# EAGLE design stmbluepill (EAGLE 9.6.2)
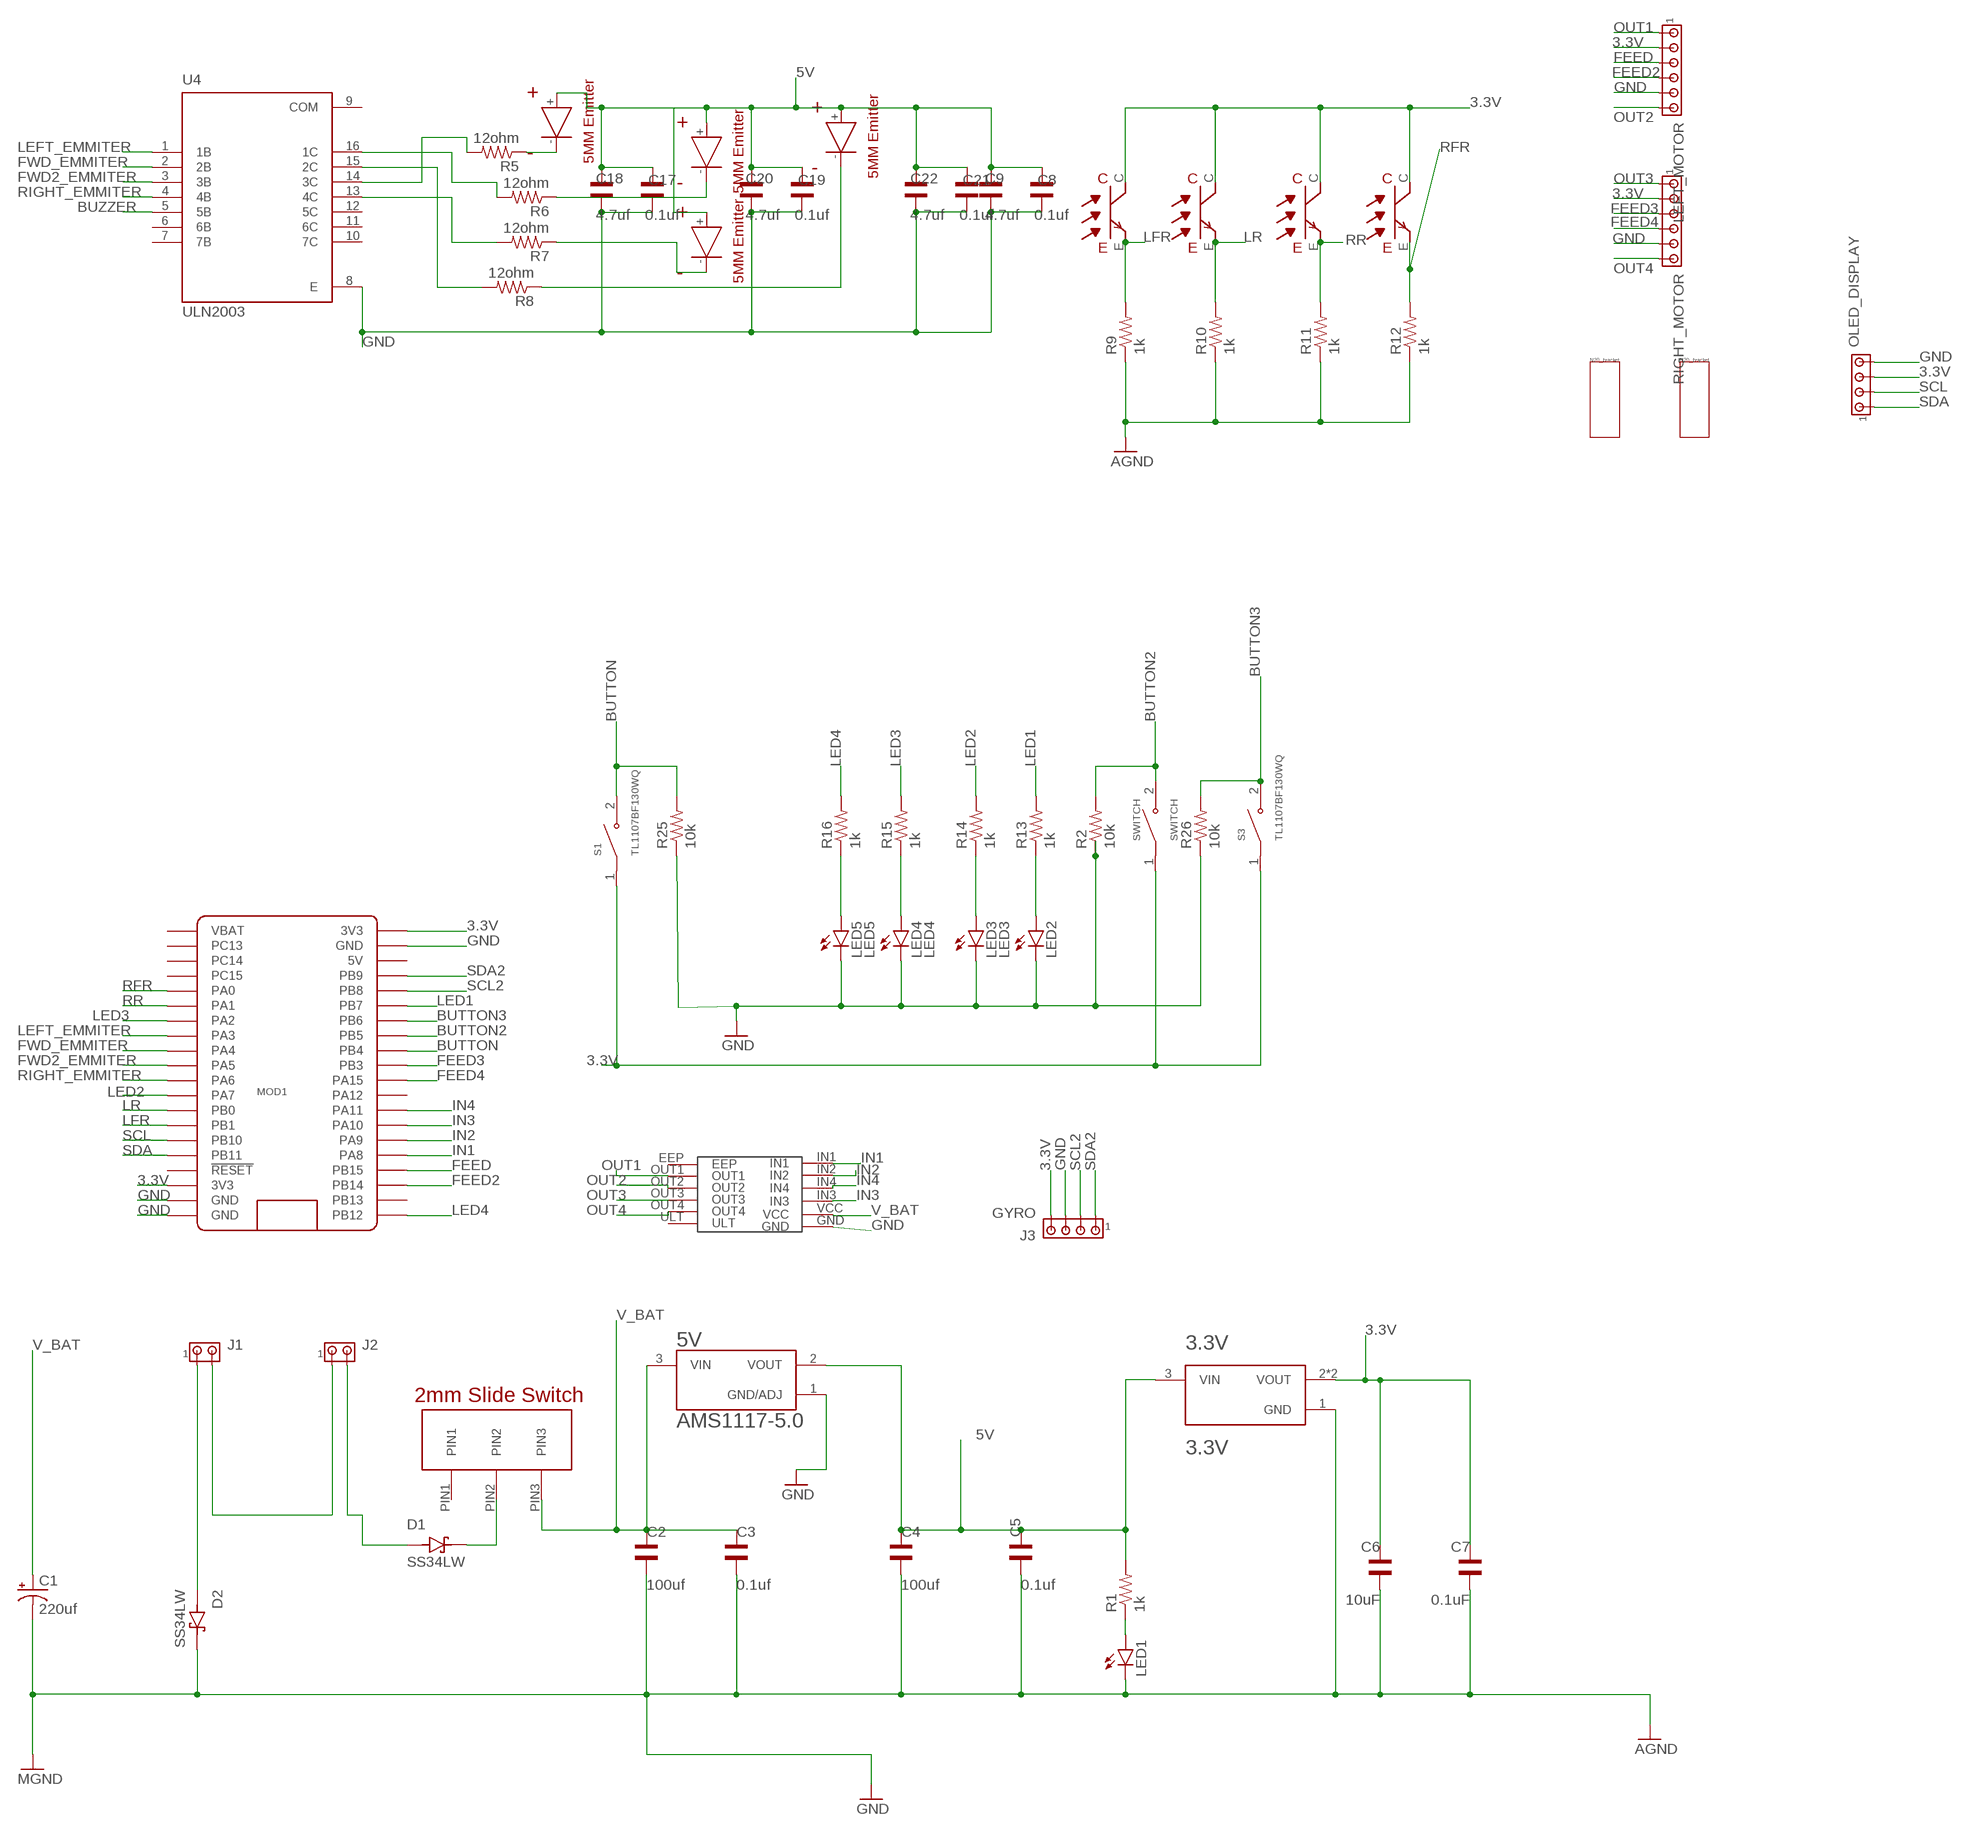
[diagram p0: schematic, sheet 1]

## Parts
3.3V  3.3V  LDL1117S33R  [SOT230P700X180-4N]
5V  AMS1117-5.0  [SOT229P700X180-4N]
C1  220uf  CAP_POL1206  [EIA3216]
C2  100uf  885012206026  [WCAP-CSGP_885012206026]
C3  0.1uf  885012206026  [WCAP-CSGP_885012206026]
C4  100uf  885012206026  [WCAP-CSGP_885012206026]
C5  0.1uf  885012206026  [WCAP-CSGP_885012206026]
C6  10uF  885012206026  [WCAP-CSGP_885012206026]
C7  0.1uF  885012206026  [WCAP-CSGP_885012206026]
C8  0.1uf  885012206026  [WCAP-CSGP_885012206026]
C9  4.7uf  885012206026  [WCAP-CSGP_885012206026]
C17  0.1uf  885012206026  [WCAP-CSGP_885012206026]
C18  4.7uf  885012206026  [WCAP-CSGP_885012206026]
C19  0.1uf  885012206026  [WCAP-CSGP_885012206026]
C20  4.7uf  885012206026  [WCAP-CSGP_885012206026]
C21  0.1uf  885012206026  [WCAP-CSGP_885012206026]
C22  4.7uf  885012206026  [WCAP-CSGP_885012206026]
D1  SS34LW  [SODFL3718X102N]
D2  SS34LW  [SODFL3718X102N]
EMMI1  EMITTER  [EMITTER]
J1  MTA02-100  [10X02MTA]
J2  MTA02-100  [10X02MTA]
J3  GYRO  MTA04-100  [10X04MTA]
LED1  LEDCHIPLED_0805  [CHIPLED_0805]
LED2  LEDCHIPLED_0805  [CHIPLED_0805]
LED3  LED3  LEDCHIPLED_0805  [CHIPLED_0805]
LED4  LED4  LEDCHIPLED_0805  [CHIPLED_0805]
LED5  LED5  LEDCHIPLED_0805  [CHIPLED_0805]
LEFT_MOTOR  MTA06-100  [10X06MTA]
MOD1  BLUE_PILLADVANCED  [BLUE_PILL_ADV]
OLED_DISPLAY  MTA04-100  [10X04MTA]
R1  1k  RESISTOR0603-RES  [0603-RES]
R2  10k  RESISTOR0603-RES  [0603-RES]
R5  12ohm  RESISTOR0603-RES  [0603-RES]
R6  12ohm  RESISTOR0603-RES  [0603-RES]
R7  12ohm  RESISTOR0603-RES  [0603-RES]
R8  12ohm  RESISTOR0603-RES  [0603-RES]
R9  1k  RESISTOR0603-RES  [0603-RES]
R10  1k  RESISTOR0603-RES  [0603-RES]
R11  1k  RESISTOR0603-RES  [0603-RES]
R12  1k  RESISTOR0603-RES  [0603-RES]
R13  1k  RESISTOR0603-RES  [0603-RES]
R14  1k  RESISTOR0603-RES  [0603-RES]
R15  1k  RESISTOR0603-RES  [0603-RES]
R16  1k  RESISTOR0603-RES  [0603-RES]
R25  10k  RESISTOR0603-RES  [0603-RES]
R26  10k  RESISTOR0603-RES  [0603-RES]
RIGHT_MOTOR  MTA06-100  [10X06MTA]
S1  TL1107BF130WQ  [SW_TL1107BF130WQ]
S3  TL1107BF130WQ  [SW_TL1107BF130WQ]
SWITCH  SWITCH  TL1107BF130WQ  [SW_TL1107BF130WQ]
U4  ULN2003  ULN2003APWR  [SOP65P640X120-16N]
U$1  N20_BRACKET  [BRACKER]
U$4  N20_BRACKET  [BRACKER]
U$8  2MMS_SLIDE_SWITCH  [2MMS_SLIDE_SWITCH]
U$11  DRV8833  [DRV8833]
U$12  RECEIVER  [RECEIVER]
U$13  EMITTER  [EMITTER]
U$14  EMITTER  [EMITTER]
U$15  EMITTER  [EMITTER]
U$16  RECEIVER  [RECEIVER]
U$17  RECEIVER  [RECEIVER]
U$18  RECEIVER  [RECEIVER]

## Nets
3.3V: 3.3V.2(VOUT) 3.3V.4(VOUT) C6.2 C7.2 J3.4 LEFT_MOTOR.2 MOD1.P$20(3V3) MOD1.P$23(3V3) OLED_DISPLAY.3 RIGHT_MOTOR.2 S1.1 S3.1 SWITCH.1 U$12.C U$16.C U$17.C U$18.C
5V: 3.3V.3(VIN) 5V.2(VOUT) C4.2 C5.2 C8.2 C9.2 C17.2 C18.2 C19.2 C20.2 C21.2 C22.2 EMMI1.+ R1.2 U$13.+ U$14.+ U$15.+
BUTTON: MOD1.P$12(PB4) R25.2 S1.2
BUTTON2: MOD1.P$13(PB5) R2.2 SWITCH.2
BUTTON3: MOD1.P$14(PB6) R26.2 S3.2
BUZZER: U4.5(5B)
FEED: LEFT_MOTOR.3 MOD1.P$4(PB15)
FEED2: LEFT_MOTOR.4 MOD1.P$3(PB14)
FEED3: MOD1.P$11(PB3) RIGHT_MOTOR.3
FEED4: MOD1.P$10(PA15) RIGHT_MOTOR.4
FWD2_EMMITER: MOD1.P$31(PA5) U4.3(3B)
FWD_EMMITER: MOD1.P$32(PA4) U4.2(2B)
GND: 3.3V.1(GND) 5V.1(GND/ADJ) C1.C(-) C2.1 C3.1 C4.1 C5.1 C6.1 C7.1 C8.1 C9.1 C17.1 C18.1 C19.1 C20.1 C21.1 C22.1 D2.C(K) J3.3 LED1.C LED2.C LED3.C LED4.C LED5.C LEFT_MOTOR.5 MOD1.P$19(GND) MOD1.P$21(GND) MOD1.P$22(GND) OLED_DISPLAY.4 R2.1 R9.1 R10.1 R11.1 R12.1 R25.1 R26.1 RIGHT_MOTOR.5 U4.8(E) U$11.GND ; supply symbol labelled AGND, MGND
IN1: MOD1.P$5(PA8) U$11.IN1
IN2: MOD1.P$6(PA9) U$11.IN2
IN3: MOD1.P$7(PA10) U$11.IN3
IN4: MOD1.P$8(PA11) U$11.IN4
LED1: MOD1.P$15(PB7) R13.2
LED2: MOD1.P$29(PA7) R14.2
LED3: MOD1.P$34(PA2) R15.2
LED4: MOD1.P$1(PB12) R16.2
LEFT_EMMITER: MOD1.P$33(PA3) U4.1(1B)
LFR: MOD1.P$27(PB1) R9.2 U$18.E
LR: MOD1.P$28(PB0) R10.2 U$17.E
N$1: R6.1 U$13.-
N$2: J1.2 J2.1
N$4: D1.C(K) U$8.PIN2
N$5: R7.2 U4.13(4C)
N$6: R5.2 U4.14(3C)
N$7: LED1.A R1.1
N$8: R6.2 U4.16(1C)
N$9: LED2.A R13.1
N$11: D1.A J2.2
N$12: EMMI1.- R5.1
N$14: D2.A J1.1
N$15: LED3.A R14.1
N$17: R7.1 U$14.-
N$18: R8.2 U4.15(2C)
N$19: R8.1 U$15.-
N$22: LED4.A R15.1
N$25: LED5.A R16.1
OUT1: LEFT_MOTOR.1 U$11.OUT1
OUT2: LEFT_MOTOR.6 U$11.OUT2
OUT3: RIGHT_MOTOR.1 U$11.OUT3
OUT4: RIGHT_MOTOR.6 U$11.OUT4
RFR: MOD1.P$36(PA0) R12.2 U$12.E
RIGHT_EMMITER: MOD1.P$30(PA6) U4.4(4B)
RR: MOD1.P$35(PA1) R11.2 U$16.E
SCL: MOD1.P$26(PB10) OLED_DISPLAY.2
SCL2: J3.2 MOD1.P$16(PB8)
SDA: MOD1.P$25(PB11) OLED_DISPLAY.1
SDA2: J3.1 MOD1.P$17(PB9)
V_BAT: 5V.3(VIN) C1.A(+) C2.2 C3.2 U$8.PIN3 U$11.VCC
Unconnected: MOD1.P$2(PB13) MOD1.P$9(PA12) MOD1.P$18(5V) MOD1.P$24(!RESET) MOD1.P$37(PC15) MOD1.P$38(PC14) MOD1.P$39(PC13) MOD1.P$40(VBAT) U4.6(6B) U4.7(7B) U4.10(7C) U4.11(6C) U4.12(5C) U$8.PIN1 U$11.EEP U$11.ULT

## Power pins joined to a net without a drawn wire
COM: U4.9(COM)

## Library data of the parts
3.3V = LDL1117S33R:LDL1117S33R: Check availability <https://pricing.snapeda.com/parts/LDL1117S33R/STMicroelectronics/view-part?ref=eda>; AVAILABILITY: In Stock; CHECK_PRICES: https://www.snapeda.com/parts/LDL1117S33R/STMicroelectronics/view-part/?ref=eda; DESCRIPTION: Linear Voltage Regulator IC Positive Fixed 1 Output 1.2A SOT-223; MF: STMicroelectronics; MP: LDL1117S33R; PACKAGE: SOT-223 STMicroelectronics; PRICE: None; PURCHASE-URL: https://www.snapeda.com/api/url_track_click_mouser/?unipart_id=865632&manufacturer=STMicroelectronics&part_name=LDL1117S33R&search_term=ldl1117s33r; SNAPEDA_LINK: https://www.snapeda.com/parts/LDL1117S33R/STMicroelectronics/view-part/?ref=snap
5V = AMS1117-5.0:AMS1117-5.0: Check availability <https://pricing.snapeda.com/parts/AMS1117-5.0/Advanced%20Monolithic%20Systems/view-part?ref=eda>; AVAILABILITY: Not in stock; CHECK_PRICES: https://www.snapeda.com/parts/AMS1117-5.0/Advanced+Monolithic+Systems/view-part/?ref=eda; DESCRIPTION: Sot223/Pkg 1-Amp 5-Volt Low Drop Out Voltage Regulatator; MF: Advanced Monolithic Systems; MP: AMS1117-5.0; PACKAGE: SOT-223 Seeed Technology; PRICE: None; SNAPEDA_LINK: https://www.snapeda.com/parts/AMS1117-5.0/Advanced+Monolithic+Systems/view-part/?ref=snap
C1 = SparkFun:CAP_POL: Capacitor Polarized These are standard SMD and PTH capacitors. Normally 10uF, 47uF, and 100uF in electrolytic and tantalum varieties. Always verify the external diameter of the through hole cap, it varies with capacity, voltage, and manufacturer. The EIA devices should be standard.
C2-C9 C17-C22 = 0603capacitor:885012206026: WCAP-CSGP Ceramic Capacitors Characteristics Multilayer Ceramic Chip Capacitor Recommended soldering:Reflow, for 0603 and 0805 wave soldering is also allowed Operating temperature:-55 °C to +125 °C; Ceramic characteristics: Class I - NPO ; Class II -X7R, X5R High performance ceramic High capacitance stability Minimal aging Termination:Cu/Ni/Sn <http://katalog.we-online.de/media/images/eisos/WCAP-CSGP_pf2.jpg> Details see: http://katalog.we-online.de/en/pbs/WCAP-CSGP-0603? Created: 2015-01-28 2015 (C) Wurth Elektronik Check availability <https://pricing.snapeda.com/parts/885012206026/W%C3%BCrth%20Elektronik/view-part?ref=eda>; AVAILABILITY: In Stock; CHECK_PRICES: https://www.snapeda.com/parts/885012206026/Wurth+Electronics+Inc/view-part/?ref=eda; DESCRIPTION: Capacitor Multilayer Ceramic 1uF MLCC 10 V X7R Dielectric 0603 Surface Mount | Wurth Electronics 885012206026; MF: Würth Elektronik; MP: 885012206026; PACKAGE: 0603 Wurth Electronics; PRICE: None; SNAPEDA_LINK: https://www.snapeda.com/parts/885012206026/Wurth+Electronics+Inc/view-part/?ref=snap
D1 D2 = SS34LW:SS34LW: Check availability <https://pricing.snapeda.com/parts/SS34LW/Taiwan%20Semiconductor/view-part?ref=eda>; AVAILABILITY: In Stock; CHECK_PRICES: https://www.snapeda.com/parts/SS34LW/Taiwan+Semiconductor/view-part/?ref=eda; DESCRIPTION: 3A, 40V, Schottky Rectifier; MF: Taiwan Semiconductor; MP: SS34LW; PACKAGE: SOD-123W-2 Taiwan Semiconductor; PRICE: None; PURCHASE-URL: https://www.snapeda.com/api/url_track_click_mouser/?unipart_id=4812745&manufacturer=Taiwan Semiconductor&part_name=SS34LW&search_term=ss34; SNAPEDA_LINK: https://www.snapeda.com/parts/SS34LW/Taiwan+Semiconductor/view-part/?ref=snap
EMMI1 U$13-U$15 = sfh4550 & teft4300:EMITTER
J1 J2 = con-amp:MTA02-100: AMP connector
J3 OLED_DISPLAY = con-amp:MTA04-100: AMP connector
LED1-LED5 = led:LED: LED OSRAM: - CHIPLED LG R971, LG N971, LY N971, LG Q971, LY Q971, LO R971, LY R971 LH N974, LH R974 LS Q976, LO Q976, LY Q976 LO Q996 - Hyper CHIPLED LW Q18S LB Q993, LB Q99A, LB R99A - SideLED LS A670, LO A670, LY A670, LG A670, LP A670 LB A673, LV A673, LT A673, LW A673 LH A674 LY A675 LS A676, LA A676, LO A676, LY A676, LW A676 LS A679, LY A679, LG A679 - Hyper Micro SIDELED® LS Y876, LA Y876, LO Y876, LY Y876 LT Y87S - SmartLED LW L88C, LW L88S LB L89C, LB L89S, LG L890 LS L89K, LO L89K, LY L89K LS L896, LA L896, LO L896, LY L896 - TOPLED LS T670, LO T670, LY T670, LG T670, LP T670 LSG T670, LSP T670, LSY T670, LOP T670, LYG T670 LG T671, LOG T671, LSG T671 LB T673, LV T673, LT T673, LW T673 LH T674 LS T676, LA T676, LO T676, LY T676, LB T676, LH T676, LSB T676, LW T676 LB T67C, LV T67C, LT T67C, LS T67K, LO T67K, LY T67K, LW E67C LS E67B, LA E67B, LO E67B, LY E67B, LB E67C, LV E67C, LT E67C LW T67C LS T679, LY T679, LG T679 LS T770, LO T770, LY T770, LG T770, LP T770 LB T773, LV T773, LT T773, LW T773 LH T774 LS E675, LA E675, LY E675, LS T675 LS T776, LA T776, LO T776, LY T776, LB T776 LHGB T686 LT T68C, LB T68C - Hyper Mini TOPLED® LB M676 - Mini TOPLED Santana® LG M470 LS M47K, LO M47K, LY M47K Source: http://www.osram.convergy.de LUXEON: - LUMILED® LXK2-PW12-R00, LXK2-PW12-S00, LXK2-PW14-U00, LXK2-PW14-V00 LXK2-PM12-R00, LXK2-PM12-S00, LXK2-PM14-U00 LXK2-PE12-Q00, LXK2-PE12-R00, LXK2-PE12-S00, LXK2-PE14-T00, LXK2-PE14-U00 LXK2-PB12-K00, LXK2-PB12-L00, LXK2-PB12-M00, LXK2-PB14-N00, LXK2-PB14-P00, LXK2-PB14-Q00 LXK2-PR12-L00, LXK2-PR12-M00, LXK2-PR14-Q00, LXK2-PR14-R00 LXK2-PD12-Q00, LXK2-PD12-R00, LXK2-PD12-S00 LXK2-PH12-R00, LXK2-PH12-S00 LXK2-PL12-P00, LXK2-PL12-Q00, LXK2-PL12-R00 Source: www.luxeon.com KINGBRIGHT: KA-3528ASYC Source: www.kingbright.com
LEFT_MOTOR RIGHT_MOTOR = con-amp:MTA06-100: AMP connector Connection corrected 2014-09-19
MOD1 = BluePill:BLUE_PILL
R1 R2 R5-R16 R25 R26 = SparkFun:RESISTOR: Resistor Basic schematic elements and footprints for 0603, 1206, and PTH resistors.
S1 S3 SWITCH = tactical switch:TL1107BF130WQ: Check availability <https://pricing.snapeda.com/parts/TL1107BF130WQ/E-Switch/view-part?ref=eda>; AVAILABILITY: In Stock; CHECK_PRICES: https://www.snapeda.com/parts/TL1107BF130WQ/E-Switch/view-part/?ref=eda; DESCRIPTION: SWITCH TACTILE SPST-NO 0.05A 12V; MF: E-Switch; MP: TL1107BF130WQ; PACKAGE: None; PRICE: None; PURCHASE-URL: https://www.snapeda.com/api/url_track_click_mouser/?unipart_id=5002039&manufacturer=E-Switch&part_name=TL1107BF130WQ&search_term=switch tactical; SNAPEDA_LINK: https://www.snapeda.com/parts/TL1107BF130WQ/E-Switch/view-part/?ref=snap
U4 = ULN2003APWR:ULN2003APWR: 50-V, 7-ch darlington transistor array, -20C to 70C 16-TSSOP -40 to 70 Check availability <https://pricing.snapeda.com/parts/ULN2003APWR/Texas%20Instruments/view-part?ref=eda>; AVAILABILITY: In Stock; CHECK_PRICES: https://www.snapeda.com/parts/ULN2003APWR/Texas+Instruments/view-part/?ref=eda; DESCRIPTION: 50-V, 7-ch darlington transistor array, -20C to 70C; MF: Texas Instruments; MP: ULN2003APWR; PACKAGE: TSSOP-16 Texas Instruments; PRICE: None; SNAPEDA_LINK: https://www.snapeda.com/parts/ULN2003APWR/Texas+Instruments/view-part/?ref=snap
U$1 U$4 = Motor N20:N20_BRACKET
U$8 = 2MMS_SLIDE_SWITCH:2MMS_SLIDE_SWITCH
U$11 = drv8833:DRV8833
U$12 U$16-U$18 = sfh4550 & teft4300:RECEIVER

## Board
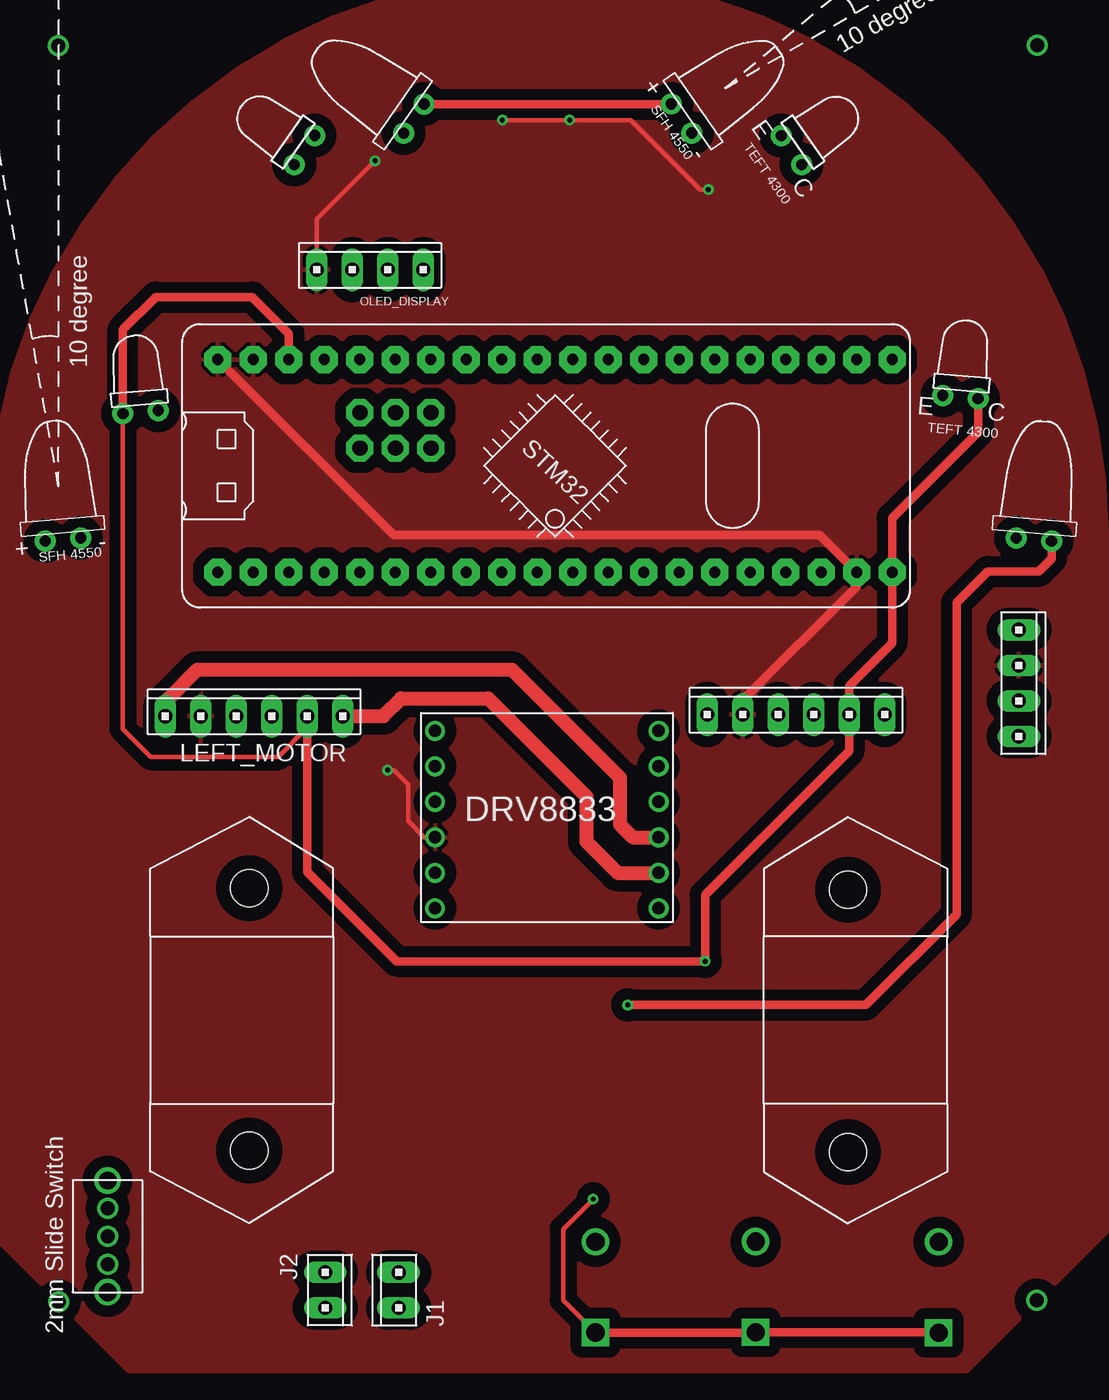
[diagram p1: board, top side]
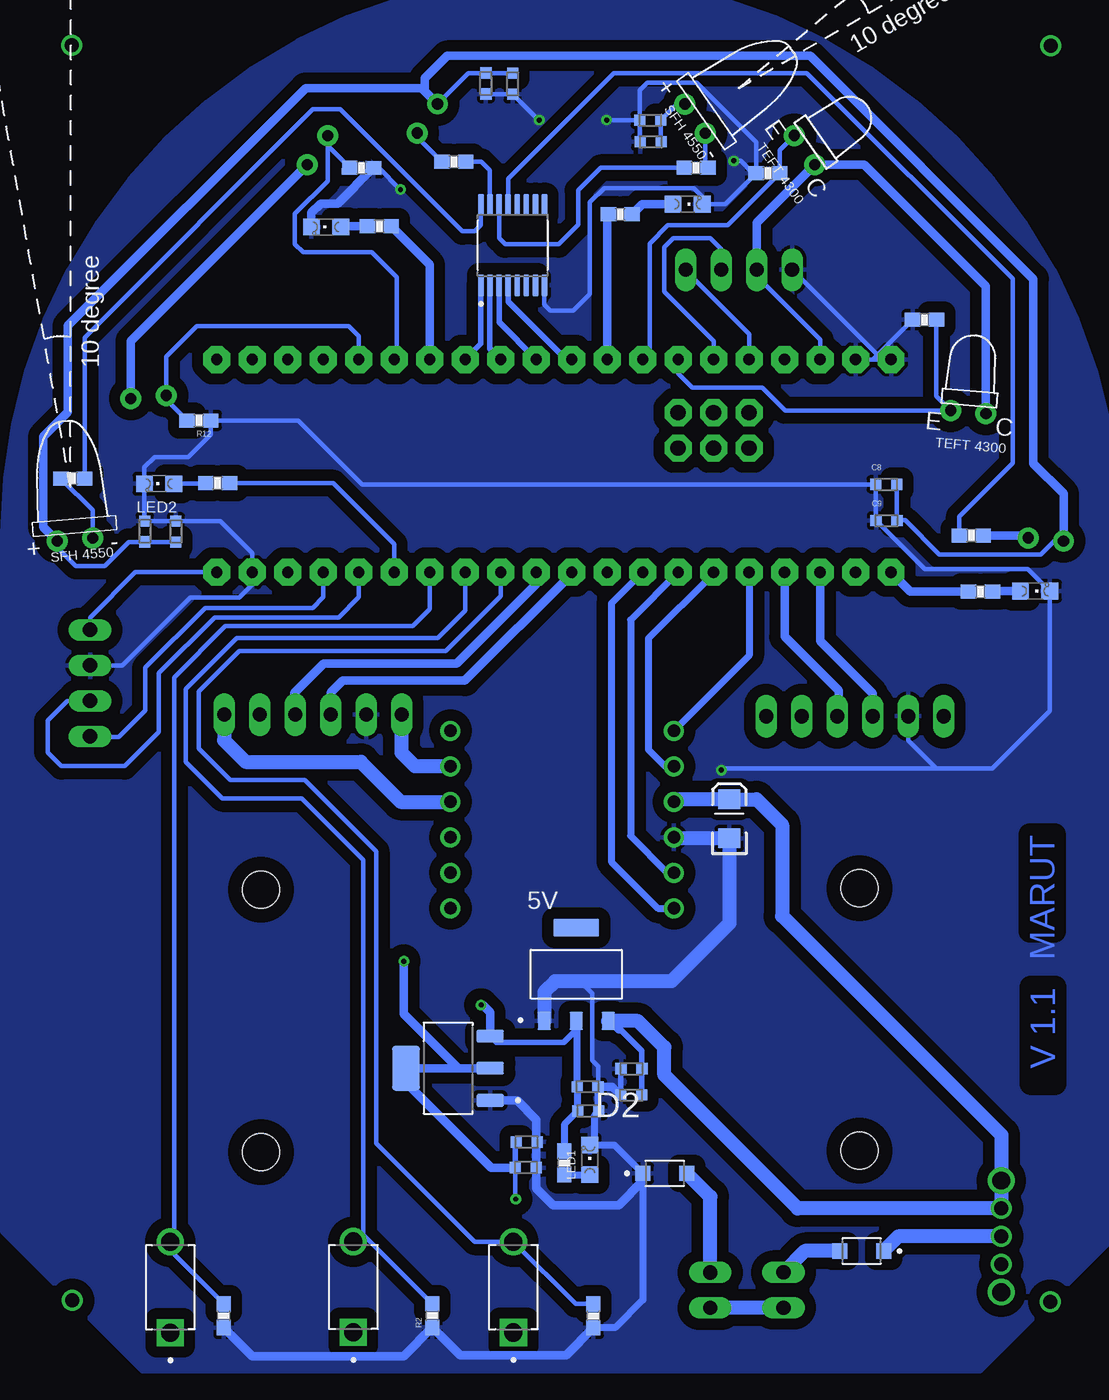
[diagram p2: board, bottom side, seen from below]

No outline drawn. Coordinates in mm, seen from the top.
Copper layers (1*16): Top 0.035mm / dielectric 1.5mm / Bottom 0.035mm
Design rules "default *": minimum track width 6mil, minimum drill 0.35mm, track to track 6mil, track to pad 6mil, pad to pad 6mil, via to via 6mil, smd to smd 6mil, copper to edge 40mil, drill to drill 6mil, minimum pad ring 10mil, minimum via ring 8mil, stop-mask expansion 4mil, vias tented up to drill 0mil, thermal gap 10mil

### Footprints (pad centres in the part's own frame; a part is rotated, then mirrored left to right if it is on the bottom)
SOT230P700X180-4N = smd 1.98 x 0.93: 1 -3.015,2.3; 2 -3.015,0; 3 -3.015,-2.3 | smd 1.98 x 3.23: 4 3.015,0
SOT229P700X180-4N = smd 0.93 x 1.31: 1 -2.29,-3.345; 2 0,-3.345; 3 2.29,-3.345 | smd 3.24 x 1.31: 4 0,3.345
EIA3216 = smd 1.4 x 1.6: A 1.4,0; C -1.4,0
WCAP-CSGP_885012206026 = smd 0.8 x 0.8: 1 -0.75,0; 2 0.75,0
SODFL3718X102N = smd 1.08 x 1.09: A 1.575,0; C -1.575,0
EMITTER = drill 0.8 pad 1.5: + -1.27,-0.5; - 1.27,-0.5
10X02MTA = drill 1.016 long: 1 1.27,0; 2 -1.27,0
10X04MTA = drill 1.016 long: 1 3.81,0; 2 1.27,0; 3 -1.27,0; 4 -3.81,0
CHIPLED_0805 = smd 1.2 x 1.2: A 0,-1.05; C 0,1.05
10X06MTA = drill 1.016 long: 1 6.35,0; 2 3.81,0; 3 1.27,0; 4 -1.27,0; 5 -3.81,0; 6 -6.35,0
BLUE_PILL_ADV = drill 0.8 pad 1.93 octagon: P$1 10.16,-30.48; P$2 10.16,-27.94; P$3 10.16,-25.4; P$4 10.16,-22.86; P$5 10.16,-20.32; P$6 10.16,-17.78; P$7 10.16,-15.24; P$8 10.16,-12.7; P$9 10.16,-10.16; P$10 10.16,-7.62; P$11 10.16,-5.08; P$12 10.16,-2.54; P$13 10.16,0; P$14 10.16,2.54; P$15 10.16,5.08; P$16 10.16,7.62; P$17 10.16,10.16; P$18 10.16,12.7; P$19 10.16,15.24; P$20 10.16,17.78; P$21 -5.08,-30.48; P$22 -5.08,-27.94; P$23 -5.08,-25.4; P$24 -5.08,-22.86; P$25 -5.08,-20.32; P$26 -5.08,-17.78; P$27 -5.08,-15.24; P$28 -5.08,-12.7; P$29 -5.08,-10.16; P$30 -5.08,-7.62; P$31 -5.08,-5.08; P$32 -5.08,-2.54; P$33 -5.08,0; P$34 -5.08,2.54; P$35 -5.08,5.08; P$36 -5.08,7.62; P$37 -5.08,10.16; P$38 -5.08,12.7; P$39 -5.08,15.24; P$40 -5.08,17.78 | drill 1.1 pad 1.93 octagon: P$42 -1.27,-20.32; P$43 -1.27,-17.78; P$44 -1.27,-15.24; P$45 1.27,-15.24; P$46 1.27,-17.78; P$47 1.27,-20.32
0603-RES = smd 1.1 x 1: 1 -0.85,0; 2 0.85,0
SW_TL1107BF130WQ = drill 1.3 square: 1 -3.25,0 | drill 1.3: 2 3.25,0
SOP65P640X120-16N = smd 1.57 x 0.41: 1 -2.87,2.275; 2 -2.87,1.625; 3 -2.87,0.975; 4 -2.87,0.325; 5 -2.87,-0.325; 6 -2.87,-0.975; 7 -2.87,-1.625; 8 -2.87,-2.275; 9 2.87,-2.275; 10 2.87,-1.625; 11 2.87,-0.975; 12 2.87,-0.325; 13 2.87,0.325; 14 2.87,0.975; 15 2.87,1.625; 16 2.87,2.275
BRACKER = hole 2.66: -3.43,7.1; 15.35,7.1
2MMS_SLIDE_SWITCH = drill 1.27 pad 1.905: P$4 -4,0; P$5 4,0 | drill 1 pad 1.524: PIN1 -2,0; PIN2 0,0; PIN3 2,0
DRV8833 = drill 0.9 pad 1.422: EEP 1,14; GND 17,8.92; IN1 17,1.3; IN2 17,3.84; IN3 17,11.46; IN4 17,14; OUT1 1,11.46; OUT2 1,8.92; OUT3 1,6.38; OUT4 1,3.84; ULT 1,1.3; VCC 17,6.38
RECEIVER = drill 0.8 pad 1.5: C 1.27,-0.5; E -1.27,-0.5

### Placement (x,y rotation side)
3.3V  58.1,21.71 180 bottom
5V  48.92,28.44 0 bottom
C1  37.97,39.57 90 bottom
C2  44.96,21.68 0 bottom
C3  44.99,19.79 0 bottom
C4  48.11,20.38 180 bottom
C5  48.06,18.64 180 bottom
C6  52.47,16.42 180 bottom
C7  52.53,14.59 180 bottom
C8  26.74,63.51 0 bottom
C9  26.72,60.92 0 bottom
C17  43.62,89.6 0 bottom
C18  43.59,88.04 0 bottom
C19  77.58,60.13 270 bottom
C20  79.81,60.15 270 bottom
C21  55.39,92.22 90 bottom
C22  53.47,92.19 90 bottom
D1  28.5,8.62 180 bottom
D2  42.58,14.18 0 bottom
EMMI1  40.01,90 305 bottom
J1  39.33,5.81 90 top
J2  34.08,5.82 270 top
J3  83.73,49.28 270 top
LED1  47.95,15.15 0 bottom
LED2  78.78,63.56 90 bottom
LED3  40.95,83.58 270 bottom
LED4  66.83,81.94 90 bottom
LED5  16.07,55.87 270 bottom
LEFT_MOTOR  28.98,46.91 0 top
MOD1  56.87,67.38 270 top
OLED_DISPLAY  37.28,78.88 0 top
R1  49.77,14.93 90 bottom
R2  59.22,3.99 90 bottom
R5  40.34,86.17 180 bottom
R6  84.96,63.94 0 bottom
R7  20.64,59.86 180 bottom
R8  57.68,86.61 0 bottom
R9  24,75.3 0 bottom
R10  35.2,85.79 0 bottom
R11  64.29,86.18 179.5 bottom
R12  75.93,68.09 180 bottom
R13  74.59,63.6 0 bottom
R14  45.77,82.85 180 bottom
R15  63.02,81.98 0 bottom
R16  19.99,55.83 180 bottom
R25  47.69,3.97 90 bottom
R26  74.15,3.98 90 bottom
RIGHT_MOTOR  67.77,47.03 0 top
S1  53.42,6.03 90 bottom
S3  77.98,6.02 90 bottom
SWITCH  64.88,6.04 90 bottom
U4  53.47,80.64 90 bottom
U$1  21.54,31.16 270 top
U$4  78.59,19.15 90 top
U$8  18.5,9.67 90 top
U$11  58.94,47.16 180 top
U$12  79.58,70.27 355 top
U$13  84.84,60.06 5 bottom
U$14  15.27,60.07 5 top
U$15  59.99,90 305 top
U$16  67.85,87.74 305 top
U$17  32.18,87.74 305 bottom
U$18  20.82,69.2 355 bottom

### Tracks (layer width: path | path; a pad name or v marks a point on that pad's centre or on a via)
3.3V  (via drill 0.35)
  Top 0.305: v53.26,12.34 51.09,10.18 51.09,5.11 S1.1 | U$18.C 19.6,46 21.59,44 30.7,44 32.79,46.09
  Top 0.61: S1.1 64.87,2.78 SWITCH.1 77.96,2.79 S3.1 | LEFT_MOTOR.2 32.79,46.09 32.79,35.76 39.18,29.37 v61.27,29.37 61.27,34.1 71.58,44.41 RIGHT_MOTOR.2 71.58,49.08 74.65,52.16 MOD1.P$20 74.65,61.11 80.8,67.26 U$12.C | U$18.C 19.6,74.58 21.94,76.93 28.86,76.93 31.47,74.32 MOD1.P$23
  Bottom 0.305: OLED_DISPLAY.3 36.01,78.42 31.47,73.88 MOD1.P$23 | MOD1.P$20 80.5,57.22 83.73,53.99 J3.4 | C7.2 53.28,12.36 v53.26,12.34
  Bottom 0.406: C6.2 53.28,16.36 C7.2
  Bottom 0.61: 3.3V.2 57.38,21.71 | 57.38,21.71 3.3V.4 61.11,20.7 55,14.59 C7.2 | v61.27,29.37 61.27,25.59 57.38,21.71 | U$18.C 19.6,77.7 28.3,86.41 U$17.C 36.01,82.25 36.01,78.42 | U$16.C 80.8,73.78 U$12.C
5V  (via drill 0.35)
  Top 0.61: v55.73,26.23 72.76,26.23 79.26,32.73 79.26,55.04 81.5,57.28 85.16,57.28 86.07,58.19 U$13.+ | U$15.+ EMMI1.+
  Bottom 0.305: C8.2 25.99,60.95 | 25.99,60.95 C9.2 | U$14.+ 14.72,59.46 15.68,58.5 22.94,58.5 25.39,60.95 25.99,60.95 | C22.2 53.49,92.97 C21.2 56.64,92.97 U$15.+ | U$13.+ 86.07,58.99 84.75,57.67 82.69,57.67 80.96,59.4 C20.2 77.6,59.4 C19.2 | C18.2 42.87,88.07 C17.2 41.72,90.75 EMMI1.+
  Bottom 0.406: 5V.2 48.92,24.46 49.82,23.57 54.64,23.57 3.3V.3
  Bottom 0.508: R1.2 49.77,17.67 C5.2 48.86,18.69 C4.2 48.86,25.03 5V.2
  Bottom 0.61: 3.3V.3 55.08,25.72 55.6,26.23 v55.73,26.23 | U$15.+ 59.75,91.65 | 59.75,91.65 59.98,91.88 68.3,91.88 85.31,74.87 85.31,68.67 87.06,66.92 87.06,60.45 U$13.+ | U$14.+ 14.04,62.85 16.2,65 16.2,78.21 32.18,94.19 58.17,94.19 59.75,92.61 59.75,91.65
BUTTON
  Bottom 0.305: MOD1.P$12 54.33,55.5 58.26,51.57 73.05,51.57 75.93,48.69 75.93,44.61 73.68,42.35 68.36,42.35 63.24,37.24 63.24,16.32 56.2,9.28 S1.2 48.96,4.82 R25.2
BUTTON2
  Bottom 0.305: MOD1.P$13 56.87,54.49 58.84,52.52 73.21,52.52 76.87,48.86 76.87,43.65 74.26,41.03 68.57,41.03 64.17,36.63 64.17,10.01 | 64.17,10.01 SWITCH.2 | R2.2 64.17,9.79 64.17,10.01
BUTTON3
  Bottom 0.305: MOD1.P$14 59.41,54.59 60.64,53.36 74.04,53.36 77.71,49.69 77.71,9.54 S3.2 77.98,8.66 R26.2
FEED
  Bottom 0.61: MOD1.P$4 34.01,52.62 30.15,48.76 30.15,46.29 30.25,46.38 LEFT_MOTOR.3
FEED2
  Bottom 0.61: MOD1.P$3 31.47,52.29 27.71,48.53 LEFT_MOTOR.4
FEED3
  Bottom 0.61: MOD1.P$11 51.79,56.38 57.49,50.67 67,50.67 69.1,48.57 69.1,47.09 RIGHT_MOTOR.3
FEED4
  Bottom 0.61: MOD1.P$10 49.25,57.1 56.9,49.45 65.64,49.45 66.5,48.59 RIGHT_MOTOR.4
FWD2_EMMITER
  Bottom 0.406: U4.3 54.45,75.12 MOD1.P$31
FWD_EMMITER
  Bottom 0.406: U4.2 55.1,73.23 MOD1.P$32
GND  (via drill 0.35)
  Top 0.305: v46.75,89.6 v51.57,89.6 55.94,89.6 60.92,84.62 v61.5,84.62 | v38.54,43.05 38.96,43.05 40,42.01 40,39.4 41.16,38.24 U$11.GND | v37.65,86.68 33.47,82.5 OLED_DISPLAY.4
  Top 0.61: RIGHT_MOTOR.5 63.96,48.06 72.11,56.21 MOD1.P$19 69.47,59.87 38.99,59.87 MOD1.P$21
  Bottom 0.305: MOD1.P$21 27.46,72.46 | 27.46,72.46 MOD1.P$22 27.68,72.46 R9.1 | C21.1 53.49,91.47 C22.1 51.62,89.6 v51.57,89.6 | OLED_DISPLAY.4 27.46,72.87 27.46,72.46 | R10.1 38.27,83.58 LED3.C 39.9,84.12 40.51,84.73 46.94,84.73 47.95,83.71 47.95,77.15 49.13,75.97 50.78,75.97 51.2,76.39 U4.8 | J3.3 81.42,50.55 76.56,55.41 73.04,55.41 72.11,56.34 MOD1.P$19 72.11,58.59 74.4,60.88 C19.1 79.79,60.88 C20.1 79.83,60.92 LED2.C 79.83,64.74 79.09,65.48 76.69,65.48 75.08,67.09 R12.1 68.82,68.08 64.25,63.51 C8.1 27.49,60.95 C9.1 23.99,57.45 16.6,57.45 LED5.C 15.02,47.3 19.14,43.17 23.15,43.17 | LEFT_MOTOR.5 25.17,45.19 23.15,43.17 | C4.1 47.36,21.82 47.79,22.26 47.79,27.06 48.67,27.94 | R10.1 36.05,88.01 40.3,92.26 43.86,92.26 44.37,91.75 C17.1 | C17.1 44.37,88.07 C18.1 | 23.15,43.17 38.41,43.17 v38.54,43.05 | R10.1 36.27,85.79 37.16,86.68 v37.65,86.68 | C17.1 46.73,89.6 v46.75,89.6 | v61.5,84.62 63.06,86.17 R11.1
  Bottom 0.406: C2.1 45.74,21.65 C3.1
  Bottom 0.508: R25.1 46.15,3.12 44.15,5.12 D2.C 46.17,16.2 47.63,16.2 | 47.63,16.2 LED1.C | C4.1 47.36,18.69 C5.1 47.63,18.32 47.63,16.2
  Bottom 0.61: R25.1 49.66,1.16 57.23,1.16 R2.1 61.27,1.09 72.12,1.09 R26.1 | C3.1 46.33,20.38 C4.1 | C6.1 51.78,16.36 | 51.78,16.36 C7.1 51.78,13.11 50.58,11.9 45.89,11.9 44.15,13.63 D2.C | 3.3V.1 53.16,19.41 51.78,18.02 51.78,16.36 | R11.1 65.98,83.63 67.21,83.63 67.88,82.96 LED4.C
  Bottom 1.016: U$11.GND 41.86,38.17 C1.C 37.97,32.09 42.12,27.94 48.67,27.94 50.44,27.94 51.21,27.17 5V.1
  pour Bottom (isolate 0.813): 90,60 90,10 80,0 20,0 10,10 10,60 arc-180
  pour Top (isolate 0.813): 10,60 10,10 20,0 80,0 90,10 90,60 arc180
IN1
  Bottom 0.508: MOD1.P$5 36.55,51.24 U$11.IN1
IN2
  Bottom 0.508: U$11.IN2 42.55,43.32 43.75,44.53 43.75,52.48 39.09,57.14 MOD1.P$6
IN3
  Bottom 0.508: MOD1.P$7 45.04,53.82 45.04,38.34 42.39,35.7 U$11.IN3
IN4
  Bottom 0.508: MOD1.P$8 46.41,54.99 46.41,36.48 43.09,33.16 U$11.IN4
LED1
  Bottom 0.305: MOD1.P$15 61.95,59.26 66.3,63.6 R13.2
LED2
  Bottom 0.61: MOD1.P$29 46.71,82.76 R14.2
LED3
  Bottom 0.61: MOD1.P$34 59.41,79.23 R15.2
LED4
  Bottom 0.61: MOD1.P$1 25.01,55.84 22.46,55.84 22.45,55.83 R16.2
LEFT_EMMITER
  Bottom 0.406: U4.1 55.75,73.59 MOD1.P$33
LFR
  Bottom 0.305: R9.2 23.15,69.83 U$18.E 33.98,68.81 35.62,70.45 40.63,70.45 41.63,71.45 MOD1.P$27
LR
  Bottom 0.305: U$17.E 34.35,87.45 R10.2 38.08,82.07 42.35,82.07 43.66,80.76 43.66,72.97 MOD1.P$28
N$1
  Bottom 0.305: R6.1 83.54,61.66 U$13.-
N$2
  Bottom 1.016: J2.1 39.32,4.55 J1.2
N$4
  Bottom 1.016: U$8.PIN2 25.88,9.67 D1.C
N$5
  Bottom 0.305: R7.2 21.49,61.21 17.68,65.02 17.68,78.23 32.42,92.96 46.22,92.96 53.8,85.38 U4.13
N$6
  Bottom 0.305: R5.2 47.19,86.17 48.79,84.57 48.79,82.09 50.19,80.7 54.01,80.7 54.45,81.14 U4.14
N$7
  Bottom 0.508: R1.1 47.97,14.07 LED1.A
N$8
  Bottom 0.305: U4.16 55.75,82.07 56.19,81.62 57.07,81.62 65.8,90.36 67.78,90.36 84.11,74.03 R6.2
N$9
  Bottom 0.305: LED2.A 75.49,63.56 R13.1
N$11
  Bottom 1.016: D1.A 32.56,8.62 J2.2
N$12
  Bottom 0.305: EMMI1.- 39.69,86.37 R5.1
N$13  (via drill 1 pad 1.3)
  other vias: 14.95,94.93
N$14
  Bottom 1.016: J1.1 39.33,12.5 D2.A
N$15
  Bottom 0.61: R14.1 44.2,83.58 LED3.A
N$16  (via drill 1 pad 1.3)
  other vias: 85.03,94.95
N$17
  Bottom 0.61: U$14.- 16.75,59.86 R7.1
N$18
  Bottom 0.305: R8.2 55.71,86.61 55.1,86 U4.15
N$19
  Bottom 0.305: U$15.- 60.31,88.39 R8.1
N$20  (via drill 1 pad 1.3)
  other vias: 85,5.08
N$21  (via drill 1 pad 1.3)
  other vias: 15,4.99
N$22
  Bottom 0.61: R15.1 65.74,81.98 LED4.A
N$25
  Bottom 0.61: R16.1 19.1,55.87 LED5.A
OUT1
  Top 1.016: LEFT_MOTOR.1 38.23,46.91 39.51,48.19 45.73,48.19 52.77,41.15 52.77,37.94 55.01,35.7 U$11.OUT1
OUT2
  Top 1.016: LEFT_MOTOR.6 22.63,47.95 22.87,48.19 22.87,48.18 24.93,50.24 47.44,50.24 55.16,42.52 55.16,39.17 56.09,38.24 U$11.OUT2
OUT3
  Bottom 1.016: RIGHT_MOTOR.1 74.12,45.17 72.59,43.64 64.35,43.64 61.49,40.78 U$11.OUT3
OUT4
  Bottom 1.016: U$11.OUT4 60.45,43.32 61.42,44.28 RIGHT_MOTOR.6
RFR
  Bottom 0.305: R12.2 78.27,69.58 U$12.E 78.27,72.66 76.1,74.84 65.19,74.84 64.49,74.14 MOD1.P$36
RIGHT_EMMITER
  Bottom 0.406: U4.4 53.8,76.61 49.65,72.46 MOD1.P$30
RR
  Bottom 0.305: R11.2 66.72,87.77 U$16.E 66.72,85.24 69.07,82.89 69.07,80.72 68.48,80.13 63.56,80.13 61.77,78.34 61.77,72.64 MOD1.P$35
SCL
  Bottom 0.305: OLED_DISPLAY.2 38.55,80.36 39.35,81.16 41.98,81.16 42.63,80.51 42.63,77.32 39.09,73.78 MOD1.P$26
SCL2
  Bottom 0.305: MOD1.P$16 64.49,55.43 65.93,53.99 74.81,53.99 78.8,50.01 78.8,45.8 81.24,43.35 85.78,43.35 86.76,44.33 86.76,46.6 85.34,48.01 J3.2
SDA
  Bottom 0.305: MOD1.P$25 36.55,74.26 41.09,78.8 OLED_DISPLAY.1
SDA2
  Bottom 0.305: MOD1.P$17 67.03,55.43 67.8,54.66 75.49,54.66 79.76,50.4 79.76,47.31 81.66,45.41 83.66,45.41 J3.1
V_BAT
  Bottom 0.305: 5V.3 45.9,24.36 45.64,24.36
  Bottom 0.406: C2.2 44.24,21.65 | 44.24,21.65 C3.2 | 44.24,21.65 44.24,22.96 45.64,24.36 46.37,25.09
  Bottom 1.016: 5V.3 44.5,25.09 42.62,23.21 42.62,21.21 33.08,11.67 U$8.PIN3 18.5,16.93 34.18,32.61 34.18,39.13 36.02,40.97 C1.A 41.75,40.97 U$11.VCC

### Text on the board
Bottom: MARUT | V 1.1